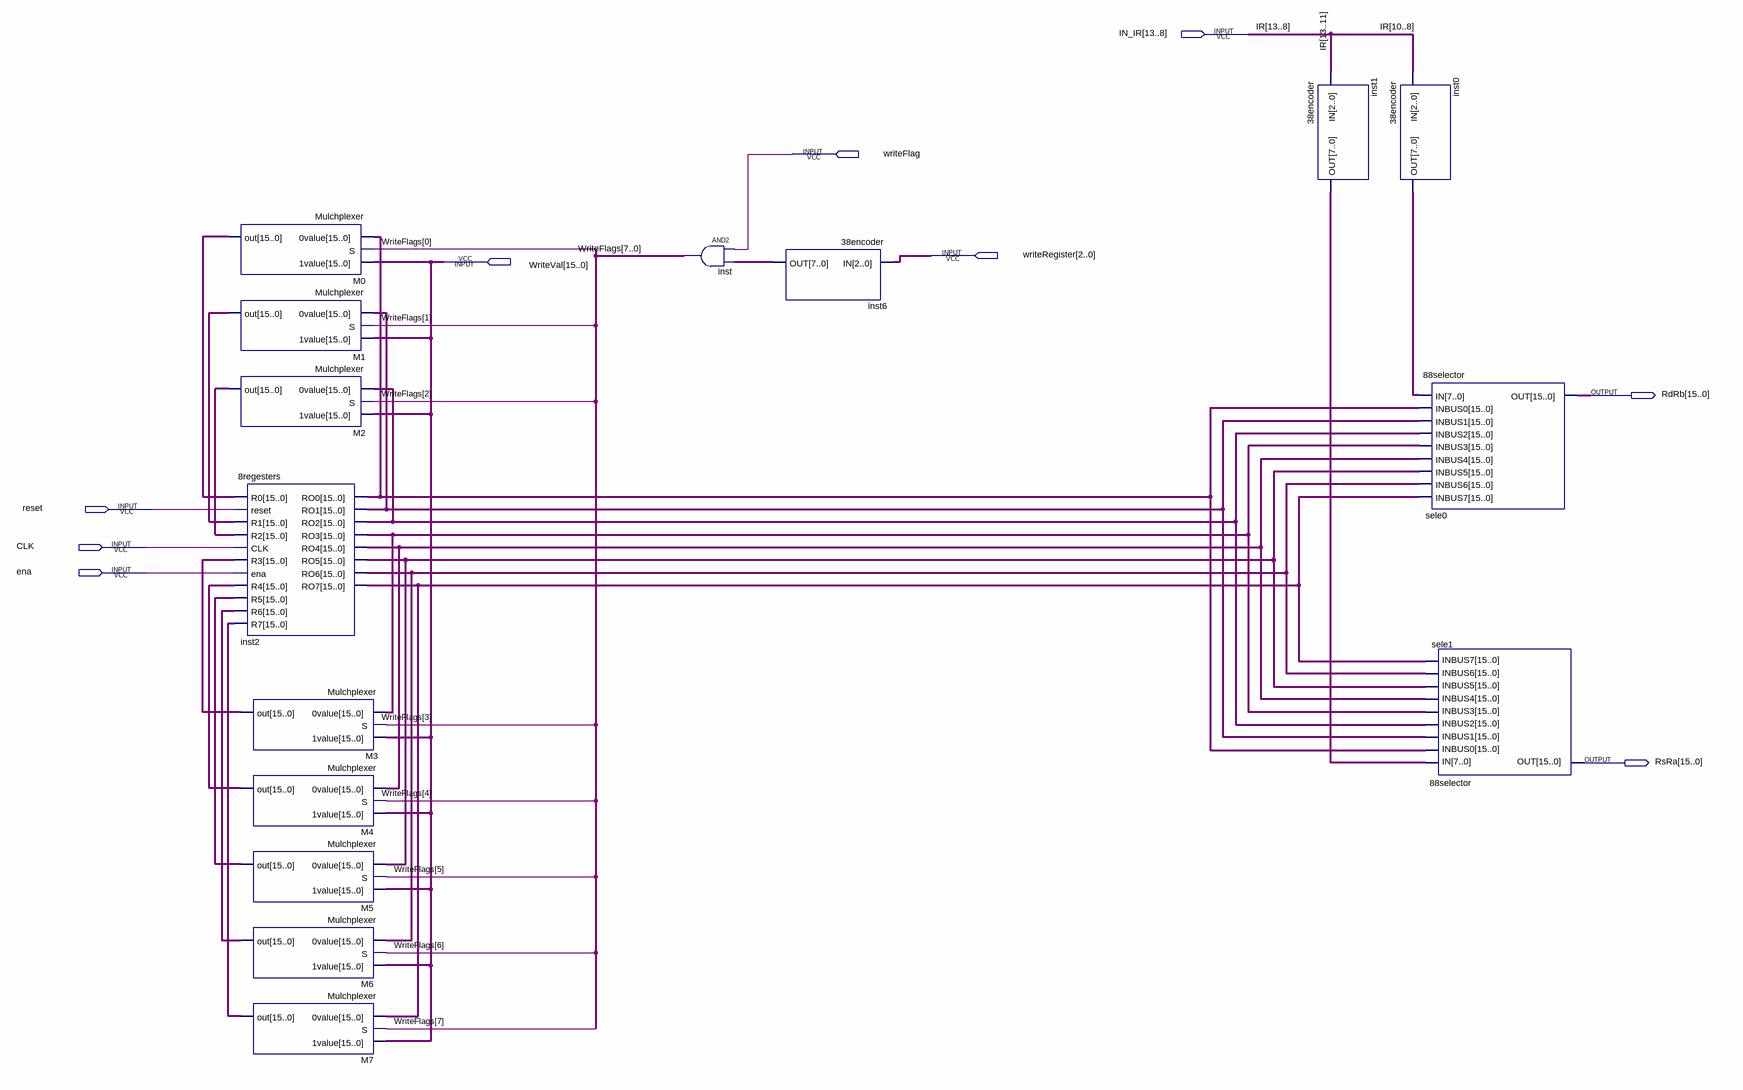
[diagram p0: schematic sheet]
// Quartus schematic phaze2.bdf as structural Verilog: 15 symbols, 9 pins
module phaze2 (
  input  [13:8] IN_IR,
  input  writeFlag,
  input  [2:0] writeRegister,
  input  [15:0] WriteVal,
  input  reset,
  input  CLK,
  input  ena,
  output [15:0] RdRb,
  output [15:0] RsRa
);

  wire [7:0] inst0_out, inst1_out, inst6_out, WriteFlags;
  wire [15:0] inst2_ro0, inst2_ro1, inst2_ro2, inst2_ro3, inst2_ro4, inst2_ro5, inst2_ro6, inst2_ro7, M0_out,
       M1_out, M2_out, M3_out, M4_out, M5_out, M6_out, M7_out;

  Mulchplexer M0 (.\0value (inst2_ro0), .S(WriteFlags[0]), .\1value (WriteVal), .out(M0_out));
  Mulchplexer M1 (.\0value (inst2_ro1), .S(WriteFlags[1]), .\1value (WriteVal), .out(M1_out));
  Mulchplexer M2 (.\0value (inst2_ro2), .S(WriteFlags[2]), .\1value (WriteVal), .out(M2_out));
  \8regesters  inst2 (
    .R0(M0_out), .reset(reset), .R1(M1_out), .R2(M2_out), .CLK(CLK), .R3(M3_out), .ena(ena), .R4(M4_out),
    .R5(M5_out), .R6(M6_out), .R7(M7_out), .RO0(inst2_ro0), .RO1(inst2_ro1), .RO2(inst2_ro2),
    .RO3(inst2_ro3), .RO4(inst2_ro4), .RO5(inst2_ro5), .RO6(inst2_ro6), .RO7(inst2_ro7));
  Mulchplexer M3 (.\0value (inst2_ro3), .S(WriteFlags[3]), .\1value (WriteVal), .out(M3_out));
  Mulchplexer M4 (.\0value (inst2_ro4), .S(WriteFlags[4]), .\1value (WriteVal), .out(M4_out));
  Mulchplexer M5 (.\0value (inst2_ro5), .S(WriteFlags[5]), .\1value (WriteVal), .out(M5_out));
  Mulchplexer M6 (.\0value (inst2_ro6), .S(WriteFlags[6]), .\1value (WriteVal), .out(M6_out));
  Mulchplexer M7 (.\0value (inst2_ro7), .S(WriteFlags[7]), .\1value (WriteVal), .out(M7_out));
  assign WriteFlags = {8{writeFlag}} & inst6_out;  // AND2 inst, 8 bits wide
  \38encoder  inst6 (.IN(writeRegister), .OUT(inst6_out));
  \38encoder  inst1 (.IN(IN_IR[13:11]), .OUT(inst1_out));
  \38encoder  inst0 (.IN(IN_IR[10:8]), .OUT(inst0_out));
  \88selector  sele0 (
    .IN(inst0_out), .INBUS0(inst2_ro0), .INBUS1(inst2_ro1), .INBUS2(inst2_ro2), .INBUS3(inst2_ro3),
    .INBUS4(inst2_ro4), .INBUS5(inst2_ro5), .INBUS6(inst2_ro6), .INBUS7(inst2_ro7), .OUT(RdRb));
  \88selector  sele1 (
    .IN(inst1_out), .INBUS0(inst2_ro0), .INBUS1(inst2_ro1), .INBUS2(inst2_ro2), .INBUS3(inst2_ro3),
    .INBUS4(inst2_ro4), .INBUS5(inst2_ro5), .INBUS6(inst2_ro6), .INBUS7(inst2_ro7), .OUT(RsRa));

  // Other names for the same wires on the sheet: IR[13:8] = IN_IR
endmodule
